# EasyEDA schematic lab6_2020-12-28_19-20-47.json
TITLE: Sheet_1; REV: 1.0; Date: 2020-12-28; Sheet: 1/1; Drawn By: ersinalcinn; Company: Your Company
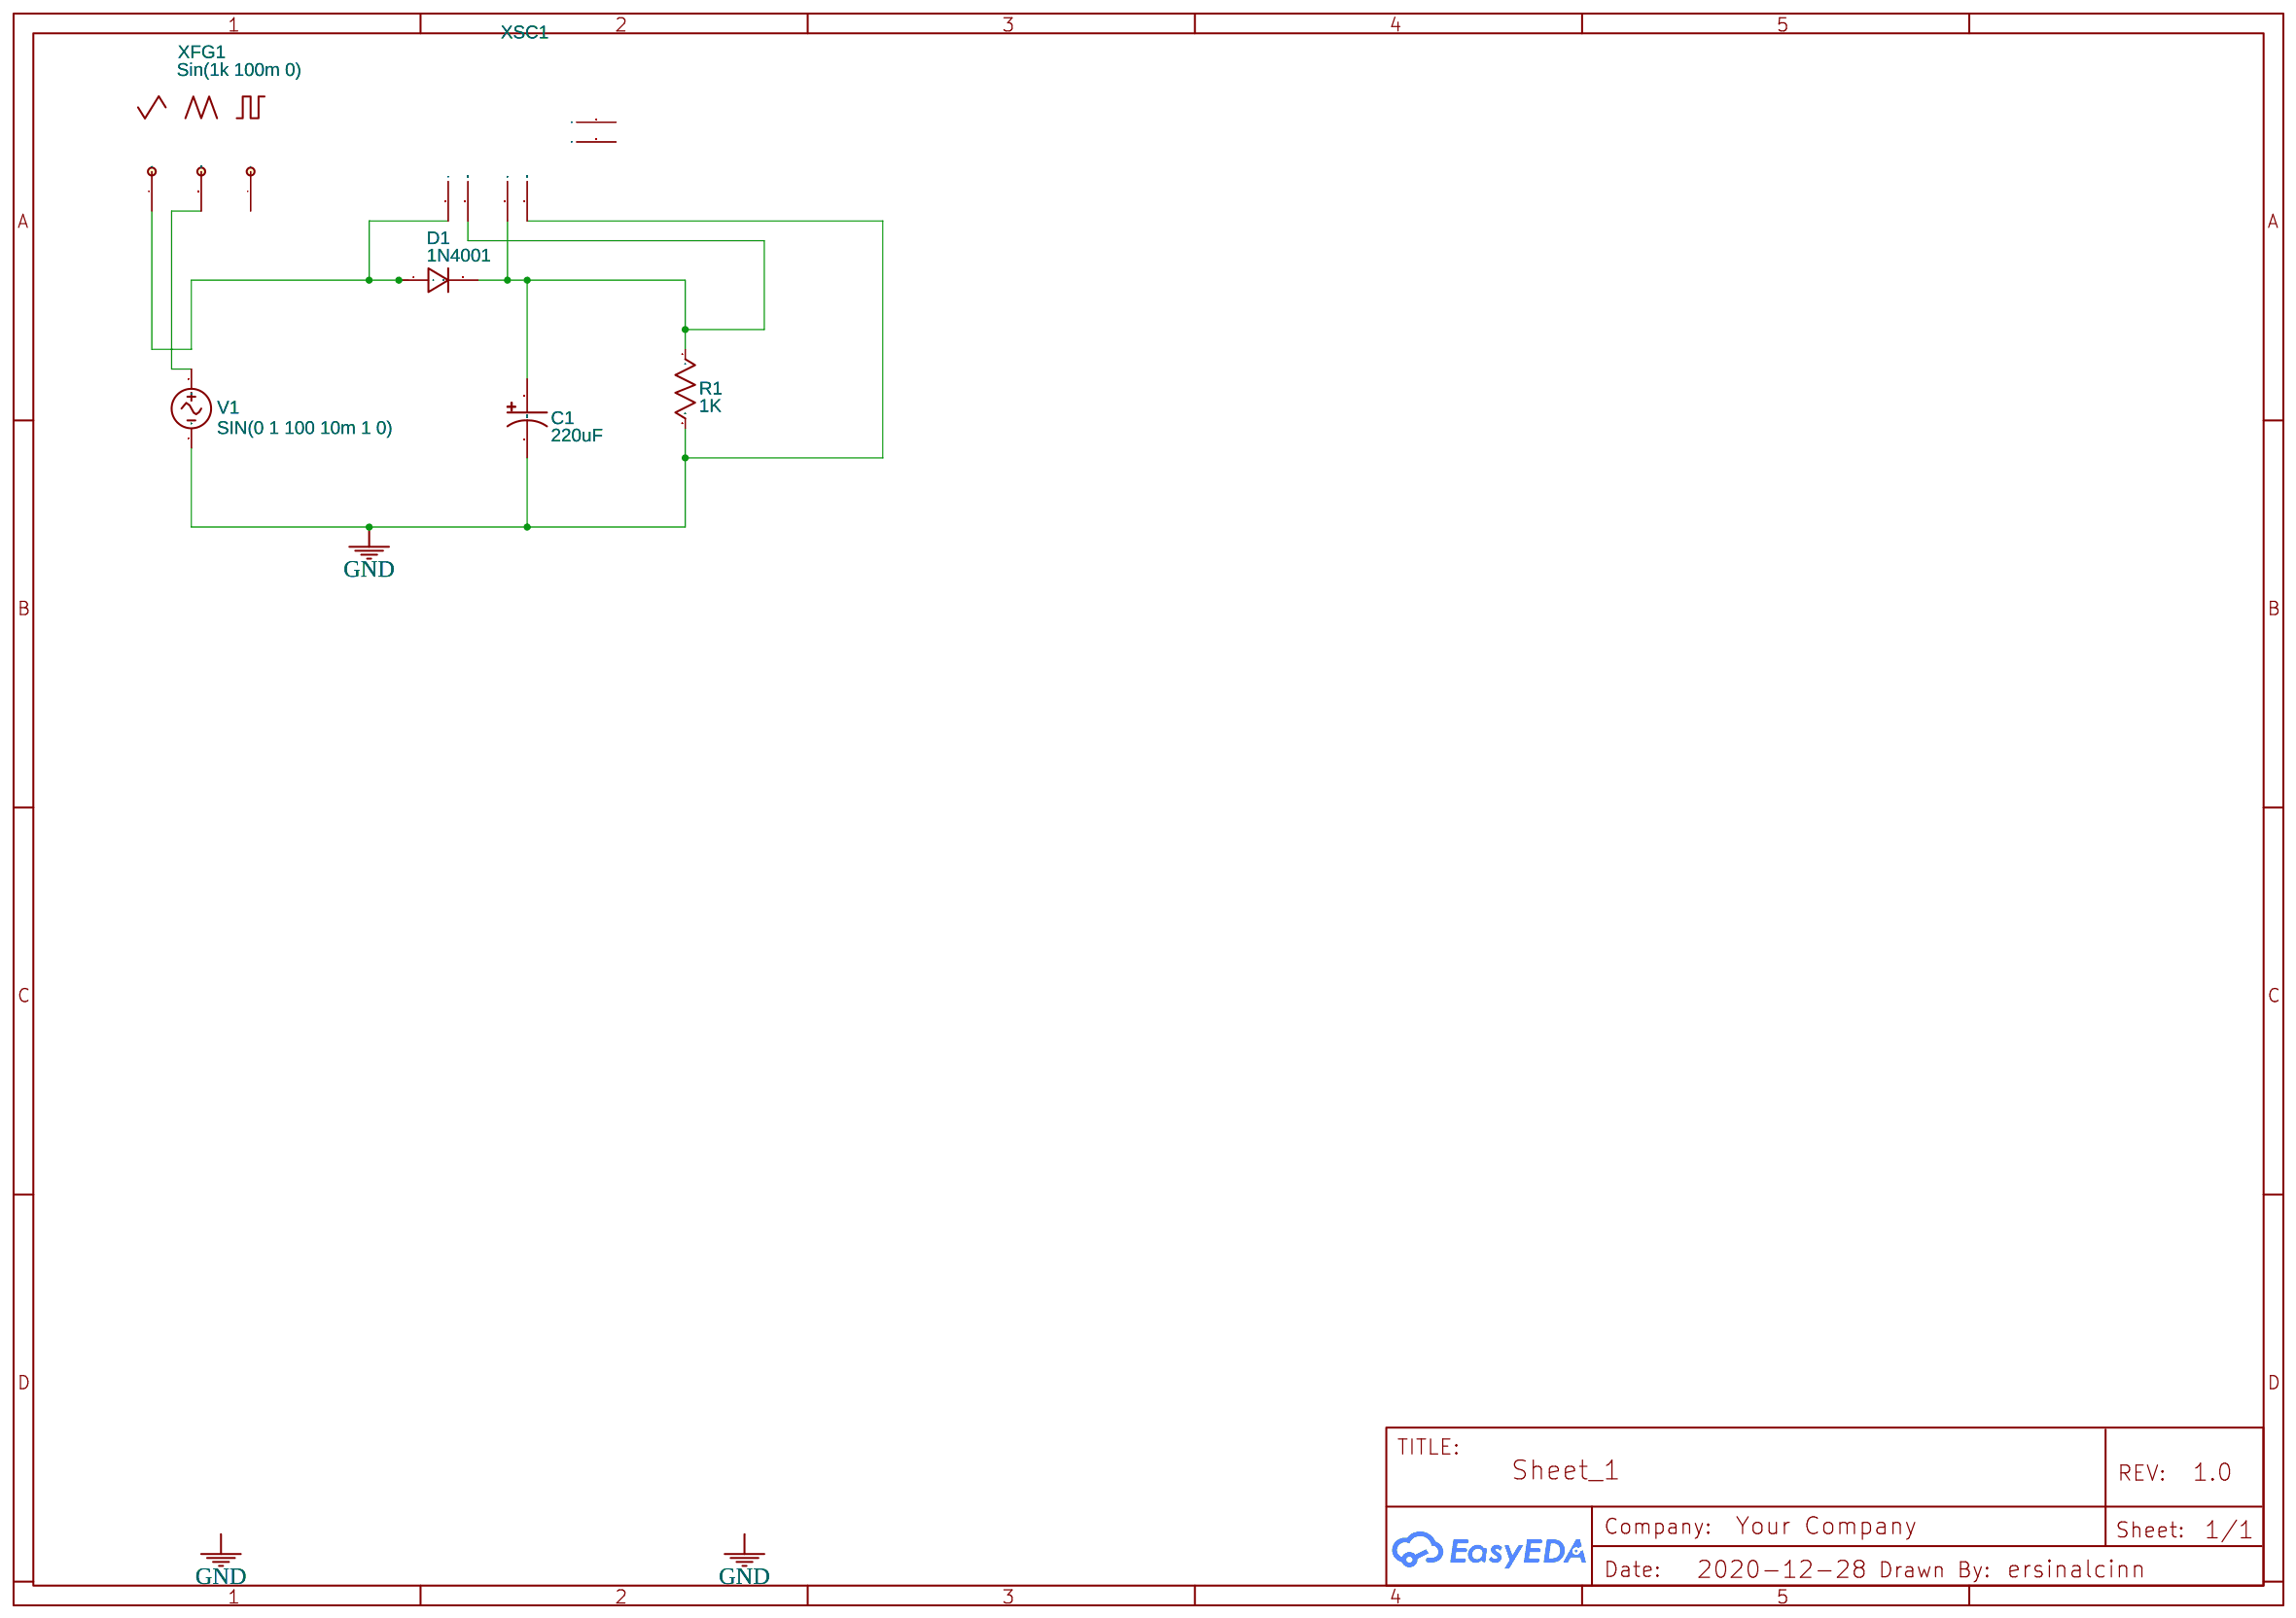
[diagram p0: schematic sheet]

## Parts
C1  220uF  [CAP-D3.0XF1.5]
D1  1N4001  [DO-35]
R1  1K  [AXIAL-0.3]
V1  SIN(0 1 100 10m 1 0)  [HDR1X2]
XFG1  Sin(1k 100m 0)
XSC1  Oscilloscope

## Library data of the parts
C1 = Capacitor_Electrolytic_US: Supplier: YUJING; Contributor: EasyEDA; Capacitance: 1u
D1 = 1N4148: Contributor: EasyEDA
R1 = Resistor_US: Resistance: 1k; Contributor: EasyEDA; Supplier: YUJING
V1 = VSin: Contributor: EasyEDA; sim: true
XFG1 = FUNCTIONGENERATOR: Supplier: LCSC; Waveforms: Sine Wave; Frequency: 1k; Duty cycle: 50; Amplitude: 100m; Offset: 0; Rise/Fall Time: 10; NameDisplay: 1; Contributor: EasyEDA; sim: true
XSC1 = OSCILLOSCOPE: Contributor: EasyEDA; NameDisplay: 0; sim: true

## Nets
GND: C1.2 R1.2 V1.2 XSC1.4(GND2)
Net-(C1-1): C1.1 D1.2(K) R1.1 XSC1.2(GND1) XSC1.3(B)
Net-(D1-1): D1.1(A) XFG1.+ XSC1.1(A)
Net-(V1-1): V1.1 XFG1.COM

Not connected (* = marked no-connect by the designer): XFG1 -; XSC1 5(T+) 6(T-)

## Notes on the sheet
- .tran 10m
